# EAGLE design tkp-v1 (EAGLE 7.3.0)
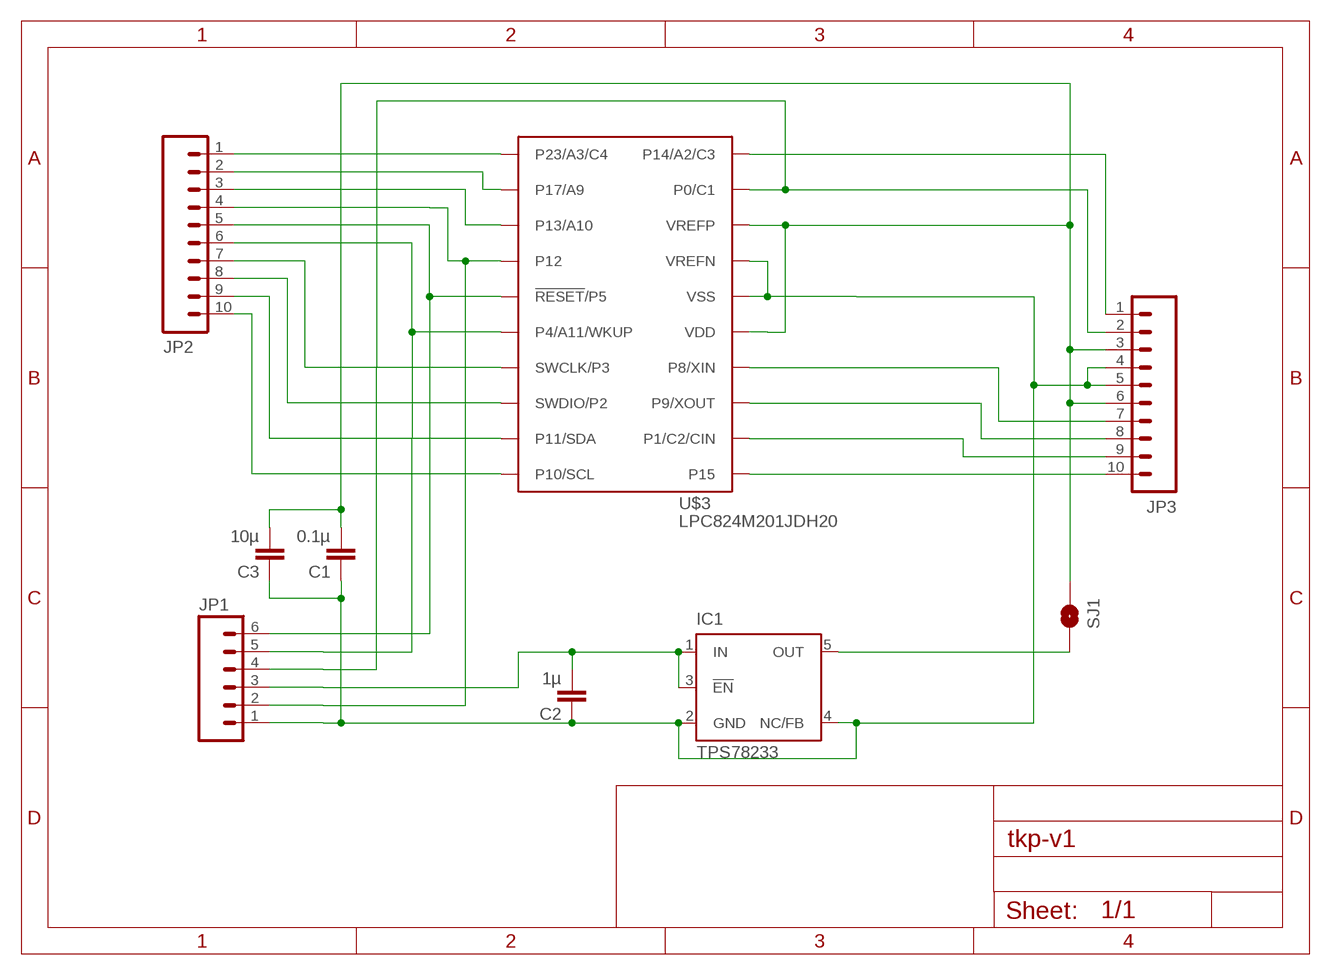
[diagram p0: schematic, sheet 1]

## Parts
C1  0.1µ  C-EUC0603K  [C0603K]
C2  1µ  C-EUC0603K  [C0603K]
C3  10µ  C-EUC0805K  [C0805K]
IC1  TPS78233  TPS77001  [SOT23-DBV]
JP1  M06LONGPADS  [1X06_LONGPADS]
JP2  M10NO_SILK_PTH_FEMALE  [1X10_NO_SILK]
JP3  M10NO_SILK_PTH_FEMALE  [1X10_NO_SILK]
SJ1  SOLDERJUMPERTRACE  [SJ_2S-TRACE]
U$3  LPC824M201JDH20  [TSSOP20]

## Nets
GND [Power]: C1.1 C2.1 C3.1 IC1.2(GND) IC1.4(NC/FB) JP1.1 JP3.4 JP3.5 U$3.16(VSS) U$3.17(VREFN)
N$1: JP2.1 U$3.1(P23/A3/C4)
N$2 [Power]: C2.2 IC1.1(IN) IC1.3(!EN) JP1.3
N$3: JP1.4 JP3.2 U$3.19(P0/C1)
N$4 [Power]: C1.2 C3.2 JP3.3 JP3.6 SJ1.1 U$3.15(VDD) U$3.18(VREFP)
N$5: JP1.5 JP2.6 U$3.6(P4/A11/WKUP)
N$6: JP2.2 U$3.2(P17/A9)
N$7: JP3.1 U$3.20(P14/A2/C3)
N$8: JP3.7 U$3.14(P8/XIN)
N$9: JP3.8 U$3.13(P9/XOUT)
N$10: JP3.9 U$3.12(P1/C2/CIN)
N$11: JP3.10 U$3.11(P15)
N$12: JP1.2 JP2.4 U$3.4(P12)
N$13: JP2.3 U$3.3(P13/A10)
N$14: JP1.6 JP2.5 U$3.5(!RESET!/P5)
N$15 [Power]: IC1.5(OUT) SJ1.2
N$16: JP2.7 U$3.7(SWCLK/P3)
N$17: JP2.8 U$3.8(SWDIO/P2)
N$18: JP2.9 U$3.9(P11/SDA)
N$19: JP2.10 U$3.10(P10/SCL)

## Library data of the parts
C1-C3 = resistor:C-EU: CAPACITOR, European symbol
IC1 = texas:TPS770*: ULTRALOW-POWER 50-mA LOW-DROPOUT LINEAR REGULATORS 50-mA Low-Dropout Regulator Source: http://focus.ti.com/lit/ds/symlink/tps77001.pdf; MF: TEXAS INSTRUMENTS; MPN: TPS77001DBVT; OC_FARNELL: 8461554; OC_NEWARK: 77C1171
JP1 = SparkFun-Connectors:M06: Header 6 Standard 6-pin 0.1" header. Use with straight break away headers (SKU : PRT-00116), right angle break away headers (PRT-00553), swiss pins (PRT-00743), machine pins (PRT-00117), and female headers (PRT-00115). Molex polarized connector foot print use with SKU : PRT-08094 with associated crimp pins and housings. NOTES ON THE VARIANTS LOCK and LOCK_LONGPADS... This footprint was designed to help hold the alignment of a through-hole component (i.e. 6-pin header) while soldering it into place. You may notice that each hole has been shifted either up or down by 0.005 of an inch from it's more standard position (which is a perfectly straight line). This slight alteration caused the pins (the squares in the middle) to touch the edges of the holes. Because they are alternating, it causes a "brace" to hold the component in place. 0.005 has proven to be the perfect amount of "off-center" position when using our standard breakaway headers. Although looks a little odd when you look at the bare footprint, once you have a header in there, the alteration is very hard to notice. Also,if you push a header all the way into place, it is covered up entirely on the bottom side. This idea of altering the position of holes to aid alignment will be further integrated into the Sparkfun Library for other footprints. It can help hold any component with 3 or more connection pins.
JP2 JP3 = SparkFun-Connectors:M10: Header 10 Standard 10-pin 0.1" header. Use with straight break away headers (SKU : PRT-00116), right angle break away headers (PRT-00553), swiss pins (PRT-00743), machine pins (PRT-00117), and female headers (PRT-00115).; PROD_ID: CONN-11563
SJ1 = SparkFun-Retired:SOLDERJUMPER: Solder Jumper Standard SMD solder jumper. Used to automate production. Two varients : Normally Open and Normally Closed are the same, but have different paste layers. NC will have a large amount of paste and should jumper during reflow.
U$3 = JeeLabs:LPC824M201JDH20

## Net classes
0 default: width 0.203 mm, clearance 0.203 mm
1 Power: width 0.305 mm, clearance 0.203 mm

## Board
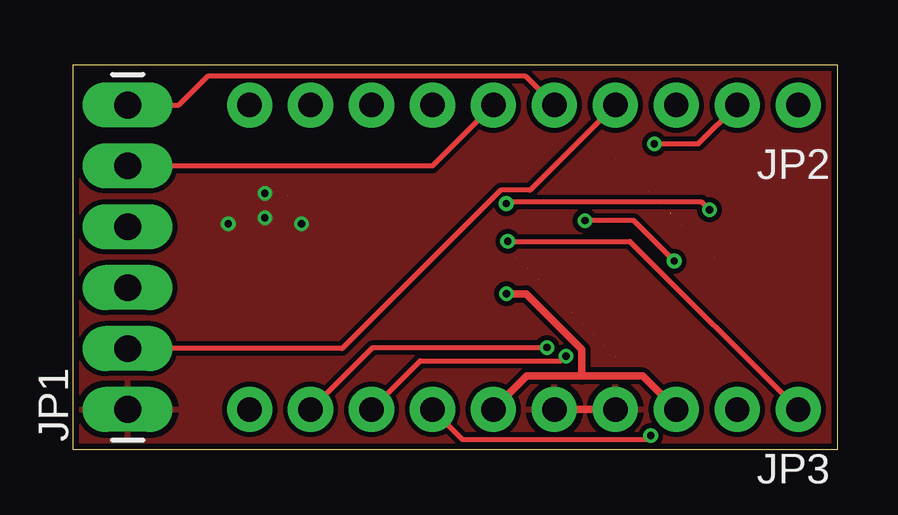
[diagram p1: board, top side]
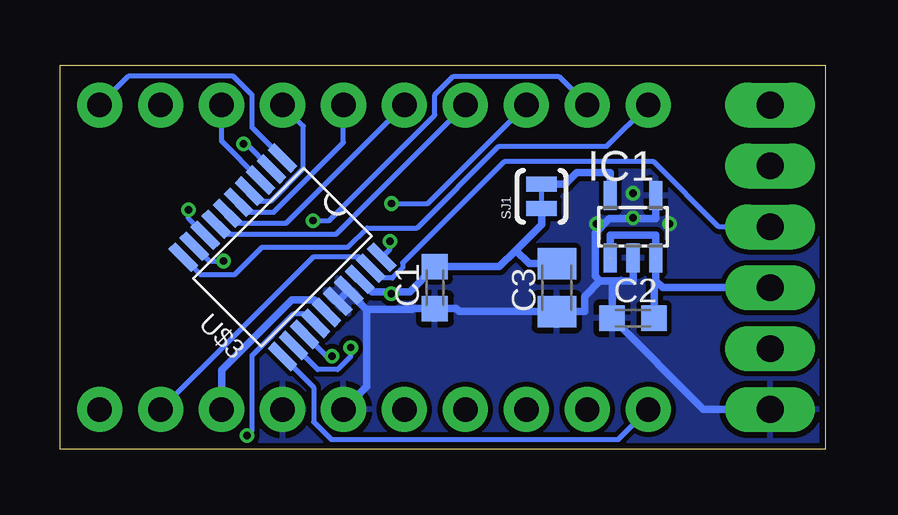
[diagram p2: board, bottom side, seen from below]

Size 31.88 x 16 mm. Coordinates in mm from the lower left corner, seen from the top.
Outline: 0,0 31.88,0 31.88,16 0,16 0,0
Copper layers (1*16): Top 0.035mm / dielectric 1.5mm / Bottom 0.035mm
Design rules "ITEADstudio_DRC": minimum track width 6mil, minimum drill 12mil, track to track 6mil, track to pad 6mil, pad to pad 6mil, via to via 6mil, smd to smd 0mil, copper to edge 10mil, drill to drill 10mil, minimum pad ring 10mil, minimum via ring 6mil, stop-mask expansion 2mil, vias tented up to drill 100mil, thermal gap 10mil

### Footprints (pad centres in the part's own frame; a part is rotated, then mirrored left to right if it is on the bottom)
C0603K = smd 1.05 x 1.08: 1 -0.875,0; 2 0.875,0
C0805K = smd 1.3 x 1.6: 1 -1,0; 2 1,0
SOT23-DBV = smd 0.55 x 1.2: 1 -0.95,-1.3; 2 0,-1.3; 3 0.95,-1.3; 4 0.95,1.3; 5 -0.95,1.3
1X06_LONGPADS = drill 1.118 pad 1.88 long: 1 0,0; 2 2.54,0; 3 5.08,0; 4 7.62,0; 5 10.16,0; 6 12.7,0
1X10_NO_SILK = drill 1.016 pad 1.88: 1 0,0; 2 2.54,0; 3 5.08,0; 4 7.62,0; 5 10.16,0; 6 12.7,0; 7 15.24,0; 8 17.78,0; 9 20.32,0; 10 22.86,0
SJ_2S-TRACE = smd 0.635 x 1.27: 1 -0.508,0; 2 0.508,0
TSSOP20 = smd 1.35 x 0.4: 1 -2.925,2.925; 2 -2.925,2.275; 3 -2.925,1.625; 4 -2.925,0.975; 5 -2.925,0.325; 6 -2.925,-0.325; 7 -2.925,-0.975; 8 -2.925,-1.625; 9 -2.925,-2.275; 10 -2.925,-2.925; 11 2.925,-2.925; 12 2.925,-2.275; 13 2.925,-1.625; 14 2.925,-0.975; 15 2.925,-0.325; 16 2.925,0.325; 17 2.925,0.975; 18 2.925,1.625; 19 2.925,2.275; 20 2.925,2.925

### Placement (x,y rotation side)
C1  16.26,6.73 90 bottom
C2  8,5.46 0 bottom
C3  11.18,6.73 90 bottom
IC1  8,9.27 0 bottom
JP1  2.29,1.65 90 top
JP2  30.23,14.35 180 top
JP3  30.23,1.65 180 top
SJ1  11.81,10.54 90 bottom
U$3  22.61,8 315 bottom

### Tracks (layer width: path | path; a pad name or v marks a point on that pad's centre or on a via)
GND  (via drill 0.3 pad 0.61)
  Top 0.305: JP3.5 JP3.4
  Bottom 0.305: 19.1,5.81 19.1,2.62 JP3.5 | 19.85,6.55 19.11,5.81 19.1,5.81 | 19.1,5.81 17.19,5.81 17.15,5.86 C1.1 15.36,5.86 15.24,5.73 C3.1 10.02,5.73 10.02,6.38 9.38,7.01 | 19.85,6.55 U$3.17 | 19.85,6.55 19.91,6.55 U$3.16 | 8.88,7.01 9.38,7.01 | 8.88,7.01 8,7.01 IC1.2 | 8.88,7.01 8.88,6.36 C2.1 5.07,1.65 JP1.1 | 9.38,7.01 9.58,7.22 9.58,9.02 8.99,9.62 7.05,9.62 IC1.4
  other vias: 6.48,9.4 8,10.67 8,9.65 9.53,9.4
  pour Top: -0.89,16.26 33.4,16.26 33.4,-0.25 -0.89,-0.25
  pour Bottom: -0.25,16.89 32.77,16.89 32.77,-0.89 -0.25,-0.89
N$1  (1 unrouted)
  Bottom 0.203: U$3.1 23.88,13.41 23.88,14.77 24.65,15.55 29.03,15.55 JP2.1
N$2  (2 unrouted)
  Bottom 0.305: JP1.3 6.77,6.73 7.05,7.01 | IC1.1 8.95,8.93 7.05,8.93 IC1.3 7.05,7.01 | 7.05,7.01 7.13,6.94 C2.2
N$3  (1 unrouted)
  Bottom 0.203: JP3.2 21.33,8.01 19.39,8.01 U$3.19 18.51,7.13 18.02,7.13 17.6,7.55 17.6,7.76 13.38,11.98 7.13,11.98 4.42,9.27 JP1.4
N$4  (via drill 0.3 pad 0.61)  (2 unrouted)
  Top 0.305: 21.21,3.05 18.92,3.05 JP3.6 | JP3.3 23.75,3.05 21.21,3.05 | v18.08,6.47 18.89,6.47 21.21,4.15 21.21,3.05
  Bottom 0.305: 18.08,6.56 17.3,6.56 C1.2 13.57,7.61 12.89,8.29 | U$3.18 18.87,6.56 18.08,6.56 | 18.08,6.56 v18.08,6.47 | U$3.15 21.28,6.22 22.22,6.22 25.15,3.29 JP3.3 | 12.89,8.29 11.81,9.36 SJ1.1 | 12.89,8.29 12.33,7.73 C3.2
N$5  (1 unrouted)
  Top 0.203: JP2.6 14.99,11.81 JP1.5
  Bottom 0.203: U$3.6 24.49,9.42 22.45,9.42 JP2.6
N$6  (via drill 0.3 pad 0.61)  (1 unrouted)
  Top 0.203: v24.23,12.73 26.07,12.73 JP2.2
  Bottom 0.203: U$3.2 24.12,12.73 v24.23,12.73
N$7  (via drill 0.3 pad 0.61)  (1 unrouted)
  Top 0.203: v18.12,8.67 23.21,8.67 JP3.1
  Bottom 0.203: U$3.20 18.12,8.35 v18.12,8.67
N$8  (via drill 0.3 pad 0.61)  (1 unrouted)
  Top 0.203: JP3.7 16.23,0.4 23.92,0.4 v24.08,0.56
  Bottom 0.203: v24.08,0.56 23.88,0.77 23.88,3.92 22.13,5.66 21.64,5.66 U$3.14
N$9  (via drill 0.3 pad 0.61)  (1 unrouted)
  Top 0.203: JP3.8 14.47,3.68 20.35,3.68 v20.55,3.88
  Bottom 0.203: v20.55,3.88 20.78,3.88 U$3.13
N$10  (via drill 0.3 pad 0.61)  (1 unrouted)
  Top 0.203: JP3.9 12.49,4.24 v19.76,4.24
  Bottom 0.203: v19.76,4.24 19.76,3.86 20.31,3.31 21.14,3.31 U$3.12
N$11  (1 unrouted)
  Bottom 0.203: U$3.11 21.31,2.57 21.31,1.14 20.58,0.41 8.61,0.41 JP3.10
N$12  (1 unrouted)
  Top 0.203: JP2.4 19.05,10.8 17.83,10.8 11.22,4.19 JP1.2
  Bottom 0.203: U$3.4 23.57,10.35 23.08,10.35 21.73,11.7 21.73,13.48 JP2.4
N$13  (1 unrouted)
  Bottom 0.203: U$3.3 25.15,12.84 JP2.3
N$14  (1 unrouted)
  Top 0.203: JP1.6 4.42,14.35 5.62,15.55 18.87,15.55 JP2.5
  Bottom 0.203: U$3.5 24.03,9.88 22.97,9.88 20.07,12.78 JP2.5
N$15  (1 unrouted)
  Bottom 0.305: SJ1.2 10.82,11.05 10.34,11.53 8.95,11.53 IC1.5
N$16  (1 unrouted)
  Bottom 0.203: U$3.7 24.95,8.96 20.37,8.96 JP2.7
N$17  (via drill 0.3 pad 0.61)  (1 unrouted)
  Top 0.203: v26.52,9.99 26.21,10.3 18.12,10.3 v18.06,10.24
  Bottom 0.203: v18.06,10.24 16.56,10.24 JP2.8 | U$3.8 26.52,9.62 v26.52,9.99
N$18  (via drill 0.3 pad 0.61)  (1 unrouted)
  Top 0.203: v25.06,7.84 23.38,9.53 v21.34,9.53
  Bottom 0.203: v21.34,9.53 20.66,9.53 16.26,13.93 16.26,14.78 15.48,15.55 11.11,15.55 JP2.9 | U$3.9 25.66,7.84 v25.06,7.84
N$19  (1 unrouted)
  Bottom 0.203: U$3.10 26.02,7.28 24.6,7.28 23.46,8.42 19.89,8.42 19.08,9.23 17,9.23 13.59,12.63 9.09,12.63 JP2.10